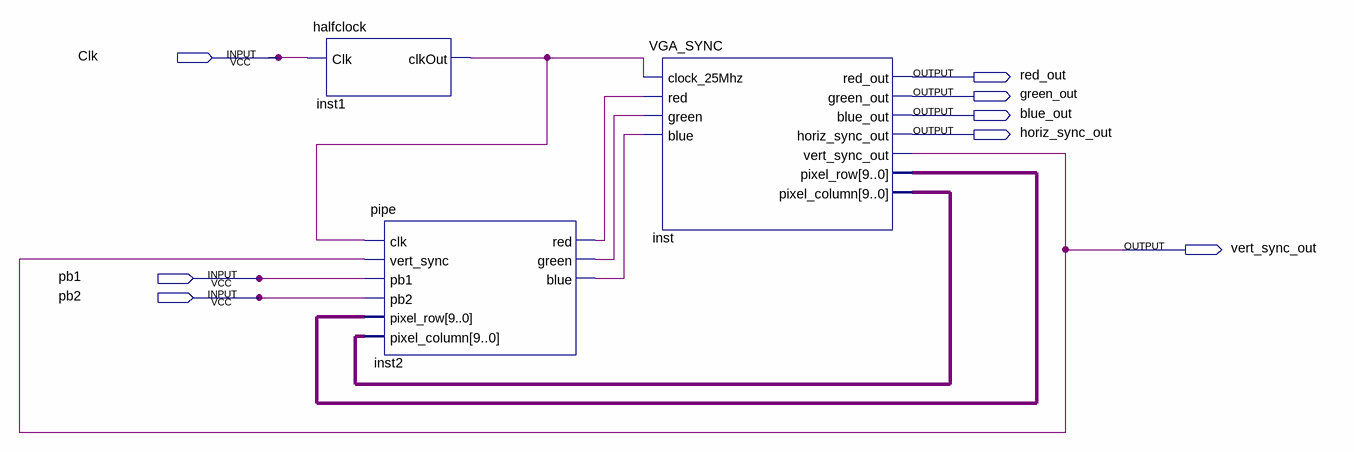
[diagram p0: schematic sheet]
// Quartus schematic pipebdf.bdf as structural Verilog: 3 symbols, 8 pins
module pipebdf (
  input  Clk,
  input  pb1,
  input  pb2,
  output red_out,
  output green_out,
  output blue_out,
  output horiz_sync_out,
  output vert_sync_out
);

  wire inst1_clkout, inst2_blue, inst2_green, inst2_red;
  wire [9:0] inst_pixel_column, inst_pixel_row;

  halfclock inst1 (.Clk(Clk), .clkOut(inst1_clkout));
  pipe inst2 (
    .clk(inst1_clkout), .vert_sync(vert_sync_out), .pb1(pb1), .pb2(pb2), .pixel_row(inst_pixel_row),
    .pixel_column(inst_pixel_column), .red(inst2_red), .green(inst2_green), .blue(inst2_blue));
  VGA_SYNC inst (
    .clock_25Mhz(inst1_clkout), .red(inst2_red), .green(inst2_green), .blue(inst2_blue), .red_out(red_out),
    .green_out(green_out), .blue_out(blue_out), .horiz_sync_out(horiz_sync_out),
    .vert_sync_out(vert_sync_out), .pixel_row(inst_pixel_row), .pixel_column(inst_pixel_column));
endmodule
